# Altium project Pegasus.PrjPcb
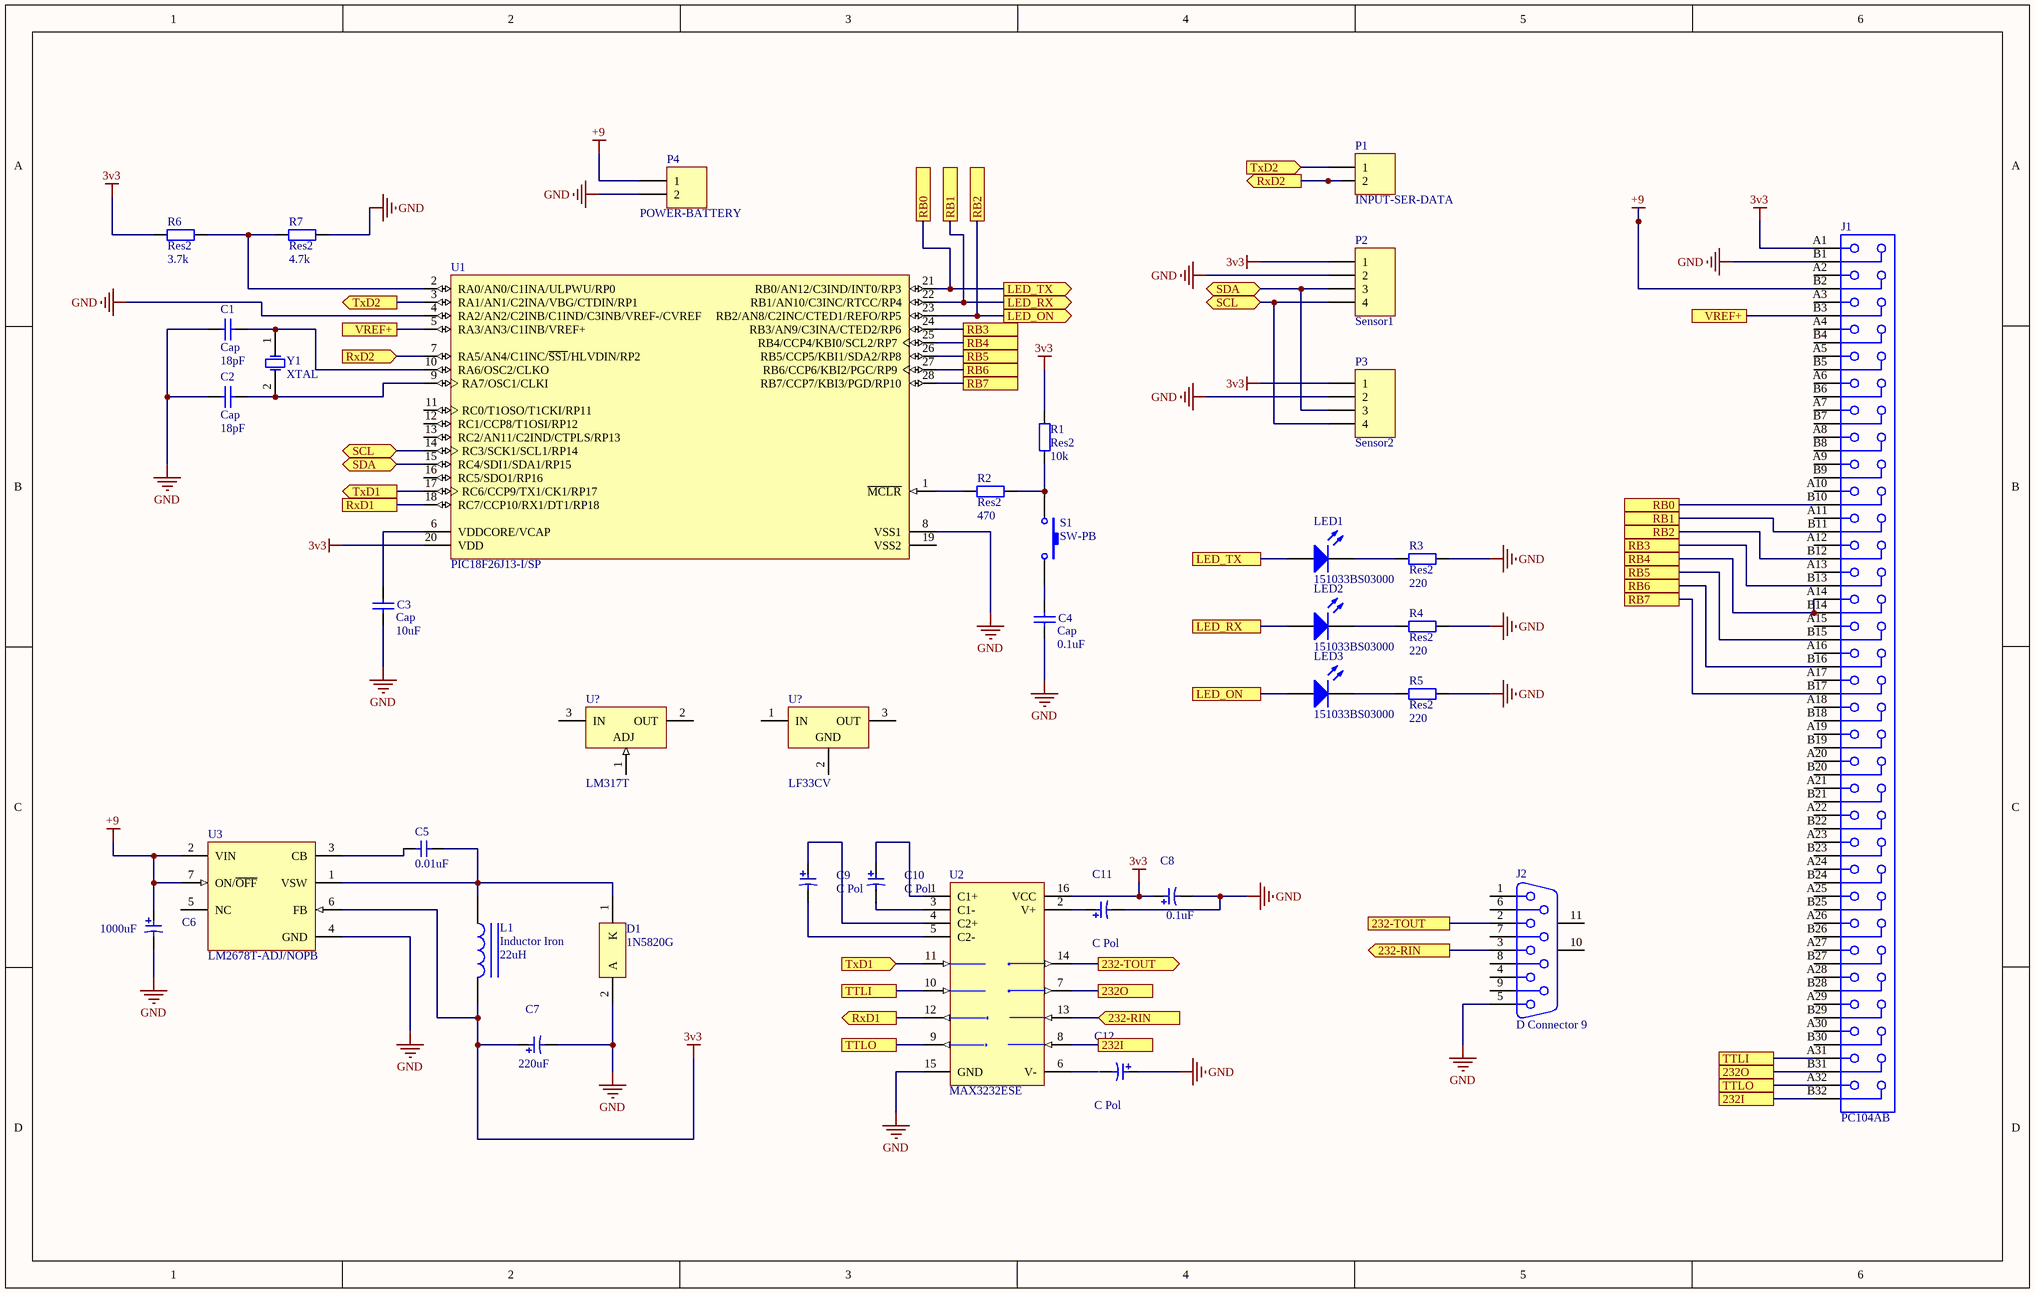
[diagram p0: Transmisor.schdoc]
1 sheet, 37 parts. Net scope: flat (ports and power ports of the same name join across sheets).
Board file: Transmisor.PCBDOC

## Sheet Transmisor.schdoc: PC-104 8 bit bus
size B; Organization: Organization; Address1: Address1; Address2: Address2; Address3: Address3; Address4: Address4; DocumentNumber: 1; Revision: 0; SheetNumber: 2; SheetTotal: 2

### Parts
(Parts that share a designator on the sheet are numbered #1, #2 ... from top to bottom, then left to right.)
C1  Cap  value 18pF  [RAD-0.3]
C2  Cap  value 18pF  [RAD-0.3]
C3  Cap  value 10uF  [RAD-0.3]
C4  Cap  value 0.1uF  [RAD-0.3]
C5  0.01uF  [C Disc 8x2.5-5.0]
C6  1000uF  [C Elec TH V 18x35-7.5]
C7  220uF  [C Elec TH V 18x35-7.5]
C8  0.1uF  [C Elec TH V 4x7-2.5]
C9  C Pol  [C Elec TH V 4x7-2.5]
C10  C Pol  [C Elec TH V 4x7-2.5]
C11  C Pol  [C Elec TH V 4x7-2.5]
C12  C Pol  [C Elec TH V 4x7-2.5]
D1  1N5820G  [ONSC-AXIAL_LEAD-2-267-05_V]
J1  PC104AB  [PC104AB]
J2  D Connector 9  [DSUB1.385-2H9]
L1  Inductor Iron  value 22uH  [AXIAL-0.9]
LED1  151033BS03000  [Type 3mm]
LED2  151033BS03000  [Type 3mm]
LED3  151033BS03000  [Type 3mm]
P1  INPUT-SER-DATA  [HDR1X2]
P2  Sensor1  [HDR1X4]
P3  Sensor2  [HDR1X4]
P4  POWER-BATTERY  [HDR1X2]
R1  Res2  value 10k  [AXIAL-0.4]
R2  Res2  value 470  [AXIAL-0.4]
R3  Res2  value 220  [AXIAL-0.4]
R4  Res2  value 220  [AXIAL-0.4]
R5  Res2  value 220  [AXIAL-0.4]
R6  Res2  value 3.7k  [AXIAL-0.4]
R7  Res2  value 4.7k  [AXIAL-0.4]
S1  SW-PB  [SPST-2]
U1  PIC18F26J13-I/SP  [MCHP-SPDIP-SP28]
U2  MAX3232ESE  [NSO16_N]
U3  LM2678T-ADJ/NOPB  [TA07B]
U?#1  LM317T  [T03B]
U?#2  LF33CV  [TO220]
Y1  XTAL  [R38]

### Ports
232-RIN (in), 232-RIN (out), 232-TOUT, 232-TOUT (out), 232I, 232O, LED_ON, LED_ON (out), LED_RX, LED_RX (out), LED_TX, LED_TX (out), RB0, RB1, RB2, RB3, RB4, RB5, RB6, RB7, RxD1, RxD1 (out), RxD2 (in), RxD2 (out), SCL (bidir), SDA (bidir), TTLI, TTLO, TxD1 (in), TxD1 (out), TxD2 (in), TxD2 (out), VREF+

### Nets
3v3: C7.2 C8.2 J1.A1 L1.2 P2.1 P3.1 R1.2 R6.1 U1.20(VDD) U2.16(VCC) U3.6(FB)
+9: C6.2 J1.B2 P4.1 U3.2(VIN) U3.7(ON/~{OFF})
GND: C1.1 C2.1 C3.1 C4.1 C6.1 C7.1 C8.1 C11.1 C12.2 D1.2(A) J1.B1 J2.5 P2.2 P3.2 P4.2 R3.2 R4.2 R5.2 R7.2 U1.4(RA2/AN2/C2INB/C1IND/C3INB/VREF-/CVREF) U1.8(VSS1) U2.15(GND) U3.4(GND)
NetC1_2: C1.2 U1.10(RA6/OSC2/CLKO) Y1.1(OSC1)
NetC2_2: C2.2 U1.9(RA7/OSC1/CLKI) Y1.2(OSC2)
NetC3_2: C3.2 U1.6(VDDCORE/VCAP)
NetC4_2: C4.2 S1.2
NetC5_1: C5.1 D1.1(K) L1.1 U3.1(VSW)
NetC5_2: C5.2 U3.3(CB)
NetC9_1: C9.1 U2.5(C2-)
NetC9_2: C9.2 U2.4(C2+)
NetC10_1: C10.1 U2.3(C1-)
NetC10_2: C10.2 U2.1(C1+)
NetC11_2: C11.2 U2.2(V+)
NetJ1_A14: J1.A14 J1.B14 U1.25(RB4/CCP4/KBI0/SCL2/RP7) ; port RB4
NetJ1_A31: J1.A31 U2.10(T2IN) ; port TTLI
NetJ1_A32: J1.A32 U2.9(R2OUT) ; port TTLO
NetJ1_B3: J1.B3 U1.5(RA3/AN3/C1INB/VREF+) ; port VREF+
NetJ1_B10: J1.B10 LED1.2(A) U1.21(RB0/AN12/C3IND/INT0/RP3) ; port LED_TX, port RB0
NetJ1_B11: J1.B11 LED2.2(A) U1.22(RB1/AN10/C3INC/RTCC/RP4) ; port LED_RX, port RB1
NetJ1_B12: J1.B12 LED3.2(A) U1.23(RB2/AN8/C2INC/CTED1/REFO/RP5) ; port LED_ON, port RB2
NetJ1_B13: J1.B13 U1.24(RB3/AN9/C3INA/CTED2/RP6) ; port RB3
NetJ1_B15: J1.B15 U1.26(RB5/CCP5/KBI1/SDA2/RP8) ; port RB5
NetJ1_B16: J1.B16 U1.27(RB6/CCP6/KBI2/PGC/RP9) ; port RB6
NetJ1_B17: J1.B17 U1.28(RB7/CCP7/KBI3/PGD/RP10) ; port RB7
NetJ1_B31: J1.B31 U2.7(T2OUT) ; port 232O
NetJ1_B32: J1.B32 U2.8(R2IN) ; port 232I
NetJ2_2: J2.2 U2.14(T1OUT) ; port 232-TOUT
NetJ2_3: J2.3 U2.13(R1IN) ; port 232-RIN
NetLED1_1: LED1.1(K) R3.1
NetLED2_1: LED2.1(K) R4.1
NetLED3_1: LED3.1(K) R5.1
NetP1_1: P1.1 U1.3(RA1/AN1/C2INA/VBG/CTDIN/RP1) ; port TxD2
NetP1_2: P1.2 U1.7(RA5/AN4/C1INC/~{SS1}/HLVDIN/RP2) ; port RxD2
NetP2_3: P2.3 P3.3 U1.15(RC4/SDI1/SDA1/RP15) ; port SDA
NetP2_4: P2.4 P3.4 U1.14(RC3/SCK1/SCL1/RP14) ; port SCL
NetR1_1: R1.1 R2.2 S1.1
NetR2_1: R2.1 U1.1(~{MCLR})
NetR6_2: R6.2 R7.1 U1.2(RA0/AN0/C1INA/ULPWU/RP0)
NetU1_17: U1.17(RC6/CCP9/TX1/CK1/RP17) U2.11(T1IN) ; port TxD1
NetU1_18: U1.18(RC7/CCP10/RX1/DT1/RP18) U2.12(R1OUT) ; port RxD1

Not connected (* = marked no-connect by the designer): C12 1; J1 A2 A3 A4 A5 A6 A7 A8 A9 A10 A11 A12 A13 A15 A16 A17 A18 A19 A20 A21 A22 A23 A24 A25 A26 A27 A28 A29 A30 B4 B5 B6 B7 B8 B9 B18 B19 B20 B21 B22 B23 B24 B25 B26 B27 B28 B29 B30; J2 1 4 6 7 8 9 10(MH1) 11(MH2); U1 11(RC0/T1OSO/T1CKI/RP11) 12(RC1/CCP8/T1OSI/RP12) 13(RC2/AN11/C2IND/CTPLS/RP13) 16(RC5/SDO1/RP16) 19(VSS2); U2 6(V-); U3 5(NC); U?#1 1(ADJ) 2(OUT) 3(IN); U?#2 1(IN) 2(GND) 3(OUT)

### Library data of the parts
C1-C4 = Cap: Capacitor; Published: 8-Jun-2000; LatestRevisionDate: 17-Jul-2002; LatestRevisionNote: Re-released for DXP Platform.; PackageReference: RAD-0.3; Publisher: Altium Limited; PackageDescription: Radial Cap, Thru-Hole; 2 Leads; 0.3 in Pin Spacing
C5 = C: Capacitor, generic
C6-C12 = C Pol: Capacitor, polarized, generic
D1 = 1N5820G: Rectifier, 2-Pin Axial_Lead, Pb-Free, Bulk Bag; Manufacturer: On Semiconductor; IFSM Max (A): 80; Configuration: Single; ComponentLink1Description: Manufacturer URL; ComponentLink2Description: Datasheet; DatasheetVersion: Rev. 10; ComponentLink3URL: http://www.onsemi.com/pub_link/Collateral/267-05.PDF; ComponentLink3Description: Package Specification; ComponentLink1URL: http://www.onsemi.com/; ComponentLink2URL: http://www.onsemi.cn/pub_link/Collateral/1N5820-D.PDF; Packing: Bulk Bag; PackageVersion: Rev. G, 06/2000; PartNumber: 1N5820G; PackageDescription: 2-Pin, Axial Lead, Diameter 5.05 mm; Mounting Technology: Through Hole; RoHS: TRUE; PackageReference: AXIAL_LEAD-2-267-05
J1 = PC104AB: 64-Pin Connector; Text Field6: Alternate Layout Available; Text Field7: Published 14-Feb-2002
J2 = D Connector 9: Receptacle Assembly, 9 Position, Right Angle; PackageDocument: O; Positions: 9; Published: 15-Jun-2001; LatestRevisionDate: 17-Jul-2002; LatestRevisionNote: Re-released for DXP Platform.; DatasheetDocument: 1-Sep-1999; PackageReference: 788750; Publisher: Altium Limited; Orientation: Right Angle; Gender: Receptacle
L1 = Inductor Iron: Magnetic-Core Inductor; Published: 24-Mar-1999; LatestRevisionDate: 17-Jul-2002; LatestRevisionNote: Re-released for DXP Platform.; PackageReference: AXIAL-0.9; Publisher: Altium Limited; PackageDescription: Axial Device, Thru-Hole; 2 Leads; 0.9 in Pin Spacing
LED1-LED3 = 151033BS03000: THT LED round mono-color waterclear, WL-TMRW , Blue; PackageReference: Type 3mm; Emitting color: Blue; PartNumber: 151033BS03000; ComponentLink1Description: Manufacturer URL; ComponentLink1URL: http://www.we-online.com; ComponentLink2Description: Datasheet; ComponentLink2URL: http://katalog.we-online.de/pbs/datasheet/7448042001.pdfhttp://katalog.we-online.de/pbs/datasheet/7448042001.pdfhttp://katalog.we-online.de/pbs/datasheet/7448042001.pdfhttp://katalog.we-online.de/pbs/datasheet/151033BS03000.pdf
P1 P4 = Header 2: Header, 2-Pin; LatestRevisionDate: 17-Jul-2002; LatestRevisionNote: Re-released for DXP Platform.; Publisher: Altium Limited
P2 P3 = Header 4: Header, 4-Pin; LatestRevisionDate: 17-Jul-2002; LatestRevisionNote: Re-released for DXP Platform.; Publisher: Altium Limited
R1-R7 = Res2: Resistor; Published: 8-Jun-2000; LatestRevisionDate: 17-Jul-2002; LatestRevisionNote: Re-released for DXP Platform.; PackageReference: AXIAL-0.4; Publisher: Altium Limited; PackageDescription: Axial Device, Thru-Hole; 2 Leads; 0.4 in Pin Spacing
S1 = SW-PB: Switch; Published: 24-Mar-1999; LatestRevisionDate: 17-Jul-2002; LatestRevisionNote: Re-released for DXP Platform.; PackageReference: SPST-2; Publisher: Altium Limited; PackageDescription: Switch; 2 Leads
U1 = PIC18F26J13-I/SP: High-Performance Microcontroller with nanoWatt XLP Technology, 48 MHz, 23 I/O, -40 to 85 degC, 28-pin SPDIP (SP28), Tube; Manufacturer: Microchip; # of A/D Channels: 10; Digital Communication: 2 -A/E/USART, 2 -MSSP(SPI/I2C); I/O Pins: 23; Internal Oscillator: 8 MHz, 31 kHz; Max. CPU Speed MHz: 48; Memory Type: Flash; Operation Voltage Range: 2.15 V - 3.6V; Program Memory KBytes: 64; Program Memory KWords: 32; RAM: 3800; Timers: 4 - 8-bit, 4 - 16-bit; DatasheetVersion: Rev. A; PackageVersion: C04-070B, 12/2012; PackageReference: SPDIP-SP28; PackageDescription: 28-Lead Plastic Dual In-Line, 34.86 x 6.79 mm Body, 2.54 mm Pitch; Supplier 1: Digi-Key; Supplier Part Number 1: PIC18F26J13-I/SP-ND; Supplier 2: Farnell; Supplier Part Number 2: 2318328; Supplier 3: Newark; Supplier Part Number 3: 63R7827; Supplier 4: Mouser; Supplier Part Number 4: 579-PIC18F26J13-I/SP; Packing: TUBE; RoHS: TRUE; Mounting Technology: Through Hole; PartNumber: PIC18F26J13-I/SP; ComponentLink1Description: Datasheet; ComponentLink1URL: http://ww1.microchip.com/downloads/en/DeviceDoc/39974A.pdf; ComponentLink2Description: Package Specification; ComponentLink2URL: http://www.microchip.com/stellent/groups/techpub_sg/documents/packagingspec/en012702.pdf; ComponentLink3Description: URL Link1; ComponentLink3URL: Product URL:http://www.microchip.com/datasheet/PIC18F26J13
U2 = MAX3232ESE: 3.0V TO 5.5V, Low-Power, up to 1Mbps, True RS-232 Transceiver Using Four 0.1µF External Capacitor; Published: 16-Jan-2001; LatestRevisionDate: 13-Apr-2006; LatestRevisionNote: IPC-7351 Footprint Added.; DatasheetVersion: Mar-1999; PackageReference: NSO16; Publisher: Altium Limited; PackageDescription: 16-Pin Small Outline Integrated Circuit 1.27 mm Pitch; Code_JEDEC: MS-012-AC; Code_IPC: SOIC127P600-16; ComponentLink1Description: Manufacturer Link; ComponentLink1URL: http://www.maxim-ic.com/; ComponentLink2Description: Datasheet; ComponentLink2URL: http://pdfserv.maxim-ic.com/en/ds/MAX3222-MAX3241.pdf
U3 = LM2678T-ADJ/NOPB: SIMPLE SWITCHER® High Efficiency 5A Step-Down Voltage Regulator, 7-pin TO-220, Pb-Free; Manufacturer: National Semiconductor; PackageTopMarking: NSUZXYTTE#*LM2678*T-ADJ; PowerWise: N; PinCount: 7; DatasheetVersion: May-2008; Code_JEDEC: TO-220-AB; PackageVersion: revC, Apr-1999; PackageReference: TA07B; PackageDescription: TO-220, Molded, .400 x .590 x .180in Body, 7 Lead, .050in Pitch, Staggered; CompType: Switcher; RoHS: Y; PartNumber: LM2678T-ADJ/NOPB
U?#1 = LM317T: 3-Terminal Adjustable Regulator, 3-pin TO-220; Manufacturer: National Semiconductor; CompType: LDO IC; PackageTopMarking: NSUZXYTTE#*LM317T P+; PowerWise: N; ComponentLink1Description: LM317 Datasheet; ComponentLink2Description: LM317 Web Page; PinCount: 3; DatasheetVersion: Apr-2007; ComponentLink1URL: http://www.national.com/ds/LM/LM317.pdf; ComponentLink2URL: http://www.national.com/pf/LM/LM317.html; RevisionNote: Component URLs added; ComponentLink3Description: T03B Package Page; PackageVersion: revL, Jan-1992; PackageDescription: TO-220, Molded, 3 Lead, Straight; ComponentLink3URL: http://www.national.com/packaging/folders/t03b.html; RoHS: N; PackageReference: T03B; PartNumber: LM317T
U?#2 = LF33CV: 500mA, Very Low Drop (0.45V) Voltage Regulator, 3.3V, 3-Pin TO-220; ComponentLink1Description: Manufacturer URL; ComponentLink2Description: Datasheet; DatasheetVersion: 1/11/2010; ComponentLink3URL: http://www.st.com/internet/com/TECHNICAL_RESOURCES/TECHNICAL_LITERATURE/PACKAGE_INFORMATION/CD00004649.pdf; ComponentLink3Description: Package Specification; ComponentLink1URL: http://www.st.com; PackageVersion: ver3.0; PackageDescription: TO, Thru-Hole, Vertical, Heatsink Mounted; 3 In-Line Leads; Pitch 2.54 mm; ComponentLink2URL: http://www.st.com/internet/com/TECHNICAL_RESOURCES/TECHNICAL_LITERATURE/DATASHEET/CD00000546.pdf; PackageReference: TO220; PartNumber: LF33CV
Y1 = XTAL: Crystal Oscillator; Published: 8-Jun-2000; LatestRevisionDate: 17-Jul-2002; LatestRevisionNote: Re-released for DXP Platform.; PackageReference: R38; Publisher: Altium Limited; PackageDescription: Crystal, Thru-Hole; 2 Leads; Body 3.1 x 8.2 mm (Dia.xH)